# Altium schematic sheet MCU.SchDoc
size A; DocumentNumber: 4; SheetNumber: 4; SheetTotal: 16
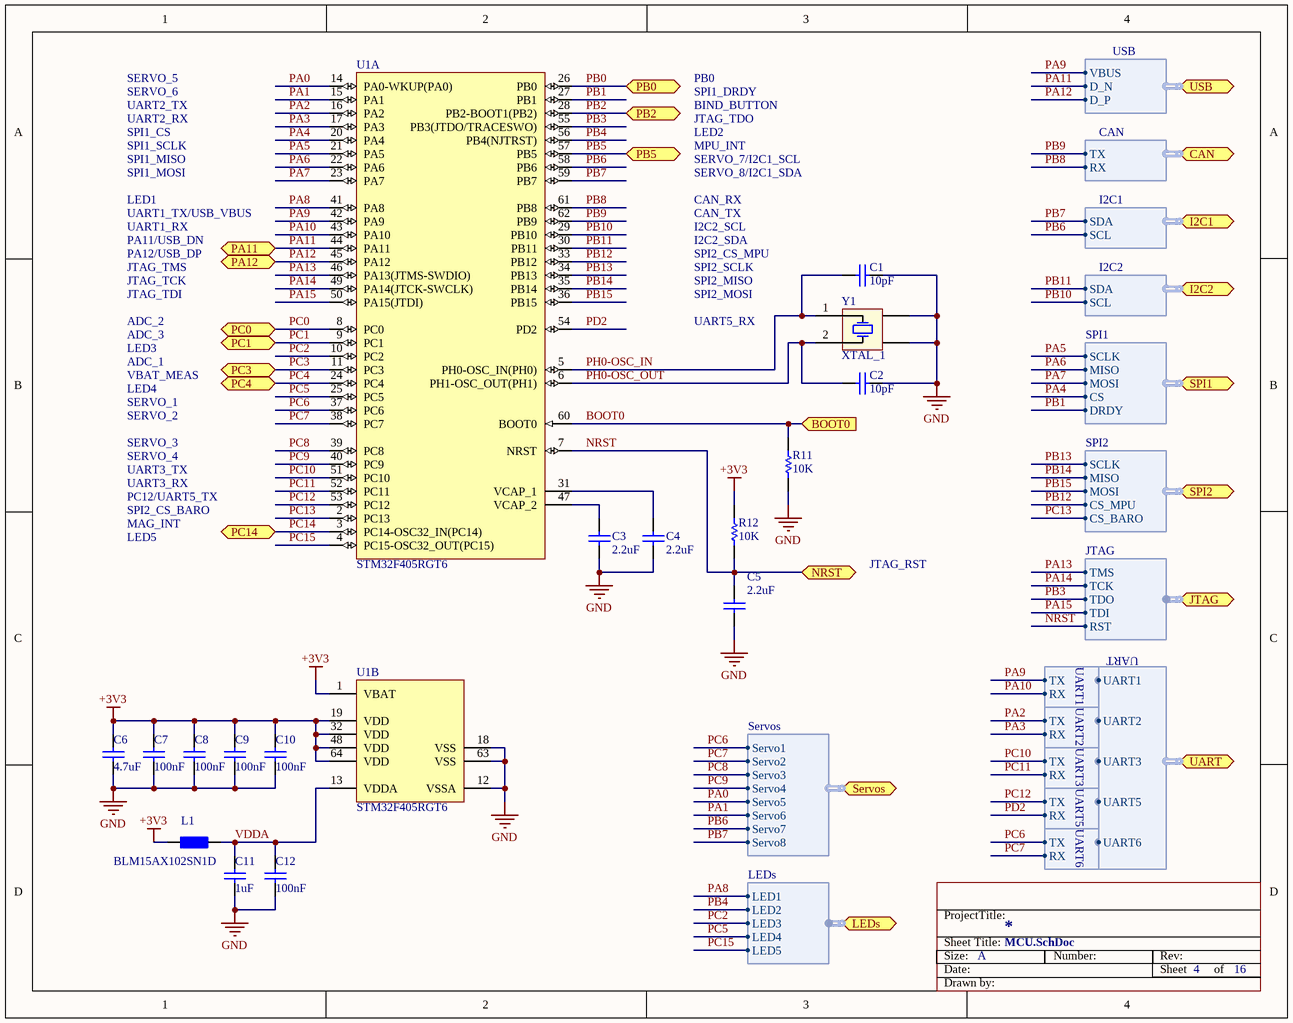
[diagram p0: MCU.SchDoc]

## Parts
C1  value 10pF  [CAP_0402[1005M]]  (hidden comment: CAP)
C2  value 10pF  [CAP_0402[1005M]]  (hidden comment: CAP)
C3  value 2.2uF  [CAP_0402[1005M]]  (hidden comment: CAP)
C4  value 2.2uF  [CAP_0402[1005M]]  (hidden comment: CAP)
C5  value 2.2uF  [CAP_0402[1005M]]  (hidden comment: CAP)
C6  value 4.7uF  [CAP_0603[1608M]]  (hidden comment: CAP)
C7  value 100nF  [CAP_0402[1005M]]  (hidden comment: Cap)
C8  value 100nF  [CAP_0402[1005M]]  (hidden comment: Cap)
C9  value 100nF  [CAP_0402[1005M]]  (hidden comment: Cap)
C10  value 100nF  [CAP_0402[1005M]]  (hidden comment: Cap)
C11  value 1uF  [CAP_0402[1005M]]  (hidden comment: CAP)
C12  value 100nF  [CAP_0402[1005M]]  (hidden comment: Cap)
L1  BLM15AX102SN1D  [GEN_0402[1005M]]
R11  value 10K  [RES_0402[1005M]]  (hidden comment: RES)
R12  value 10K  [RES_0402[1005M]]  (hidden comment: RES)
U1  STM32F405RGT6  [STM-LQFP64_N]  (parts A,B of 2)
Y1  XTAL_1  [CRYSTAL SMD3 ABM8G 3225]

## Ports
BOOT0 (in), CAN (harness CAN), I2C1 (harness I2C1), I2C2 (harness I2C2), JTAG (harness JTAG), LEDs (harness LEDs), NRST (bidir), PA11 (bidir), PA12 (bidir), PB0 (bidir), PB2 (bidir), PB5 (bidir), PC0 (bidir), PC1 (bidir), PC3 (bidir), PC4 (bidir), PC14 (bidir), Servos (harness Servos), SPI1 (harness SPI1), SPI2 (harness SPI2), UART (harness UART), USB (harness USB)

## Harnesses
Servos: Servo1, Servo2, Servo3, Servo4, Servo5, Servo6, Servo7, Servo8
JTAG: TMS, TCK, TDO, TDI, RST
CAN: TX, RX
I2C1: SDA, SCL
I2C2: SDA, SCL
LEDs: LED1, LED2, LED3, LED4, LED5
SPI1: SCLK, MOSI, MISO, CS, DRDY
SPI2: SCLK, MOSI, MISO, CS_MPU, CS_BARO
USB: VBUS, D_N, D_P
UART2: TX, RX
UART3: TX, RX
UART1: TX, RX
UART5: TX, RX
UART6: TX, RX
UART: UART1, UART2, UART3, UART5, UART6

## Nets
+3V3: C6.2 C7.1 C8.1 C9.1 C10.1 L1.1 R12.2 U1.1(VBAT) U1.19(VDD) U1.32(VDD) U1.48(VDD) U1.64(VDD)
GND: C1.1 C2.1 C3.1 C4.1 C5.1 C6.1 C7.2 C8.2 C9.2 C10.2 C11.1 C12.2 R11.1 U1.12(VSSA) U1.18(VSS) U1.63(VSS) Y1.3(GND) Y1.4(GND)
BOOT0: R11.2 U1.60(BOOT0) ; port BOOT0
NRST: C5.2 R12.1 U1.7(NRST) ; port NRST, port JTAG.RST
PA0: U1.14(PA0-WKUP(PA0)) ; port Servos.Servo5
PA1: U1.15(PA1) ; port Servos.Servo6
PA2: U1.16(PA2) ; harness UART2.TX
PA3: U1.17(PA3) ; harness UART2.RX
PA4: U1.20(PA4) ; port SPI1.CS
PA5: U1.21(PA5) ; port SPI1.SCLK
PA6: U1.22(PA6) ; port SPI1.MISO
PA7: U1.23(PA7) ; port SPI1.MOSI
PA8: U1.41(PA8) ; port LEDs.LED1
PA9: U1.42(PA9) ; port USB.VBUS, harness UART1.TX
PA10: U1.43(PA10) ; harness UART1.RX
PA11: U1.44(PA11) ; port PA11, port USB.D_N
PA12: U1.45(PA12) ; port PA12, port USB.D_P
PA13: U1.46(PA13(JTMS-SWDIO)) ; port JTAG.TMS
PA14: U1.49(PA14(JTCK-SWCLK)) ; port JTAG.TCK
PA15: U1.50(PA15(JTDI)) ; port JTAG.TDI
PB0: U1.26(PB0) ; port PB0
PB1: U1.27(PB1) ; port SPI1.DRDY
PB2: U1.28(PB2-BOOT1(PB2)) ; port PB2
PB3: U1.55(PB3(JTDO/TRACESWO)) ; port JTAG.TDO
PB4: U1.56(PB4(NJTRST)) ; port LEDs.LED2
PB5: U1.57(PB5) ; port PB5
PB6: U1.58(PB6) ; port Servos.Servo7, port I2C1.SCL
PB7: U1.59(PB7) ; port Servos.Servo8, port I2C1.SDA
PB8: U1.61(PB8) ; port CAN.RX
PB9: U1.62(PB9) ; port CAN.TX
PB10: U1.29(PB10) ; port I2C2.SCL
PB11: U1.30(PB11) ; port I2C2.SDA
PB12: U1.33(PB12) ; port SPI2.CS_MPU
PB13: U1.34(PB13) ; port SPI2.SCLK
PB14: U1.35(PB14) ; port SPI2.MISO
PB15: U1.36(PB15) ; port SPI2.MOSI
PC0: U1.8(PC0) ; port PC0
PC1: U1.9(PC1) ; port PC1
PC2: U1.10(PC2) ; port LEDs.LED3
PC3: U1.11(PC3) ; port PC3
PC4: U1.24(PC4) ; port PC4
PC5: U1.25(PC5) ; port LEDs.LED4
PC6: U1.37(PC6) ; port Servos.Servo1, harness UART6.TX
PC7: U1.38(PC7) ; port Servos.Servo2, harness UART6.RX
PC8: U1.39(PC8) ; port Servos.Servo3
PC9: U1.40(PC9) ; port Servos.Servo4
PC10: U1.51(PC10) ; harness UART3.TX
PC11: U1.52(PC11) ; harness UART3.RX
PC12: U1.53(PC12) ; harness UART5.TX
PC13: U1.2(PC13) ; port SPI2.CS_BARO
PC14: U1.3(PC14-OSC32_IN(PC14)) ; port PC14
PC15: U1.4(PC15-OSC32_OUT(PC15)) ; port LEDs.LED5
PD2: U1.54(PD2) ; harness UART5.RX
PH0-OSC_IN: C1.2 U1.5(PH0-OSC_IN(PH0)) Y1.1(OSC1)
PH0-OSC_OUT: C2.2 U1.6(PH1-OSC_OUT(PH1)) Y1.2(OSC2)
VDDA: C11.2 C12.1 L1.2 U1.13(VDDA)
NetC3_2: C3.2 U1.47(VCAP_2)
NetC4_2: C4.2 U1.31(VCAP_1)

## Notes on the sheet
- SERVO_6
- SERVO_5
- SPI1_DRDY
- PB0
- UART2_TX
- UART2_RX
- SPI1_CS
- SPI1_MISO
- SPI1_SCLK
- JTAG_TDO
- MPU_INT
- LED2
- BIND_BUTTON
- SERVO_7/I2C1_SCL
- LED1
- UART1_RX
- UART1_TX/USB_VBUS
- SPI1_MOSI
- CAN_RX
- CAN_TX
- SERVO_8/I2C1_SDA
- I2C2_SCL
- JTAG_TDI
- JTAG_TCK
- JTAG_TMS
- PA11/USB_DN
- PA12/USB_DP
- SPI2_MOSI
- SPI2_MISO
- SPI2_SCLK
- SPI2_CS_MPU
- I2C2_SDA
- LED3
- ADC_1
- ADC_3
- ADC_2
- UART5_RX
- LED4
- SERVO_2
- SERVO_1
- VBAT_MEAS
- UART3_TX
- UART3_RX
- PC12/UART5_TX
- SERVO_4
- SERVO_3
- SPI2_CS_BARO
- MAG_INT
- LED5
- JTAG_RST
- Sheet Title:
- ProjectTitle:
- Size:
- Date:
- A
- Number:
- Rev:
- Sheet         of
- Drawn by:

## Library data of the parts
C1 C2 = CAP: Capacitor; Manufacturer Part Number: CC0402JRNPO9BN100; Manufacturer: Yageo; Supplier 1: Digi-Key; Supplier Part Number 1: 311-1014-1-ND; ComponentLink1URL: http://www.yageo.com/documents/recent/UPY-GP_NP0_16V-to-50V_10.pdf; ComponentLink1Description: Datasheet
C3-C5 = CAP: Capacitor; Manufacturer: Yageo; Manufacturer Part Number: CC0402MRX5R5BB225; Supplier 1: Digi-Key; Supplier Part Number 1: 311-1442-1-ND; ComponentLink1URL: http://www.yageo.com/documents/recent/UPY-GPHC_X5R_4V-to-50V_19.pdf; ComponentLink1Description: Datasheet
C6 = CAP: Capacitor; Manufacturer: Yageo; Manufacturer Part Number: CC0603KRX5R6BB475; Supplier 1: Digi-Key; Supplier Part Number 1: 311-1455-1-ND; ComponentLink1URL: http://www.yageo.com/documents/recent/UPY-GPHC_X5R_4V-to-50V_19.pdf; ComponentLink1Description: Datasheet
C7-C10 C12 = Cap: CAP CER 0.1UF 10V 10% X7R 0402; Manufacturer: Yageo; Manufacturer Part Number: CC0402KRX7R6BB104; Supplier 1: Digi-Key; Supplier Part Number 1: 311-1345-1-ND; ComponentLink1Description: Datasheet; ComponentLink1URL: http://www.yageo.com/documents/recent/UPY-GPHC_X7R_6.3V-to-50V-v12.pdf
C11 = CAP: Capacitor; Manufacturer Part Number: CC0402KRX5R5BB105; Manufacturer: Yageo; Supplier 1: Digi-Key; Supplier Part Number 1: 311-1438-1-ND; ComponentLink1URL: http://www.yageo.com/documents/recent/UPY-GPHC_X5R_4V-to-50V_19.pdf; ComponentLink1Description: Datasheet
L1 = Bead Ferrite: Manufacturer: Murata Electronics North America; Impedance @ Frequency: 1 kOhm @ 100MHz; DC Resistance (DCR): 490 mOhm Max; Current Rating: 350mA; Supplier 1: Digi-Key; Supplier Part Number 1: 490-5442-1-ND; Manufacturer Part Number: BLM15AX102SN1D; ComponentLink1URL: http://search.murata.co.jp/Ceramy/image/img/PDF/ENG/L0110S0100BLM15AX_SN.pdf; ComponentLink1Description: Datasheet
R11 R12 = RES: Resistor; Manufacturer: Yageo; Manufacturer Part Number: RC0402FR-0710KL; Supplier 1: Digi-Key; Supplier Part Number 1: 311-10.0KLRCT-ND; ComponentLink1URL: http://www.yageo.com/NewPortal/yageodocoutput?fileName=/pdf/R-Chip/PYu-RC_Group_51_RoHS_L_3.pdf; ComponentLink1Description: Datasheet
U1 = STM32F405RGT6: ARM Cortex-M4 32-bit MCU+FPU, 210 DMIPS, 1024 kB Flash, 192 kB Internal RAM, 51 I/Os, 64-pin LQFP, -40 to 85 degC, Tray; Manufacturer: STMicroelectronics; D/A Converter: 2x12-bit; FLASH Size (Prog) (kB): 1024; I/Os (High Current): 51; Internal RAM Size (kB): 192; Operating Frequency(F) (Processor speed) (MHz): 168; Supply Voltage(Vcc) max (V): 3.6; Supply Voltage(Vcc) min (V): 1.8; DatasheetVersion: Rev. 4; PackageVersion: Rev. 4, 06/2013; PackageReference: LQFP64; PackageDescription: 64-Pin Low Profile Quad Flat Package, 10 x 10 mm Body, 0.5 mm Pitch; Supplier 1: Digi-Key; Supplier Part Number 1: 497-11767-ND; Supplier 2: Farnell; Supplier Part Number 2: 2064363; Supplier 3: Newark; Supplier Part Number 3: 73T2329; Supplier 4: Mouser; Supplier Part Number 4: 511-STM32F405RGT6; Core: ARM Cortex-M4; Packing: Tray; Mounting Technology: Surface Mount; PartNumber: STM32F405RGT6; ComponentLink2Description: Manufacturer URL; ComponentLink2URL: http://www.st.com/web/en/home.html; ComponentLink1Description: Datasheet; ComponentLink1URL: http://www.st.com/st-web-ui/static/active/en/resource/technical/document/datasheet/DM00037051.pdf; ComponentLink3Description: Package Specification; ComponentLink3URL: http://www.st.com/st-web-ui/static/active/en/resource/technical/document/datasheet/DM00037051.pdf; Manufacturer Part Number: STM32F405RGT6
Y1 = XTAL_1: Crystal Oscillator with ground points; pin to pad: 2>3 3>2; Manufacturer: Abracon LLC; Manufacturer Part Number: ABM8G-12.000MHZ-4Y-T3; Frequency Stability: ±30ppm; ESR (Equivalent Series Resistance): 120 Ohm; Frequency: 12MHz; Load Capacitance: 10pF; Supplier 1: Digi-Key; Supplier Part Number 1: 535-10901-1-ND; Frequency Tolerance: ±30ppm; ComponentLink1URL: http://www.abracon.com/Resonators/ABM8G.pdf; ComponentLink1Description: Datasheet